# Altium schematic sheet motordriver-v5.0_opto-isolation.SchDoc
size A4; SheetNumber: 4; SheetTotal: 8
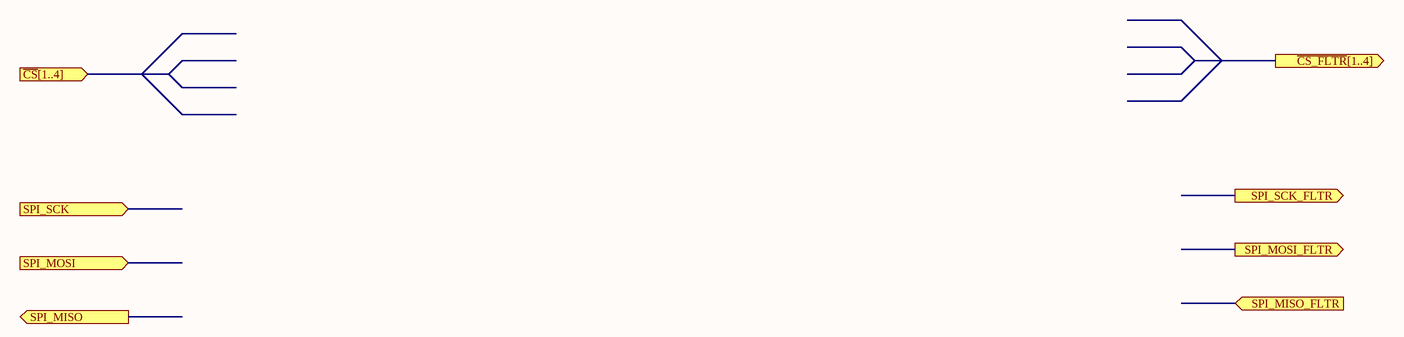
[diagram p0: motordriver-v5.0_opto-isolation.SchDoc]

## Ports
SPI_MISO (out), SPI_MISO_FLTR (in), SPI_MOSI (in), SPI_MOSI_FLTR (out), SPI_SCK (in), SPI_SCK_FLTR (out), ~{CS_FLTR}[1..4] (out), ~{CS}[1..4] (in)